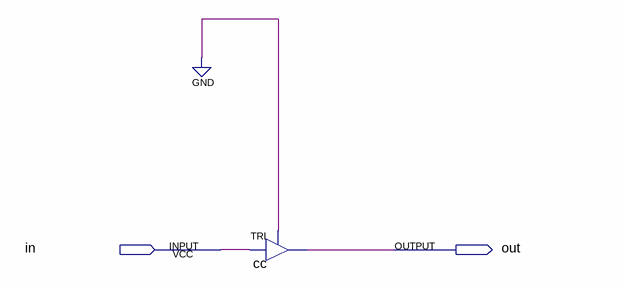
[diagram p0: schematic sheet]
// Quartus schematic Lab_2.bdf as structural Verilog: 1 symbols, 2 pins
module Lab_2 (
  input  in,
  output out
);

  TRI cc (.IN(in), .OE(1'b0), .OUT(out));
endmodule
